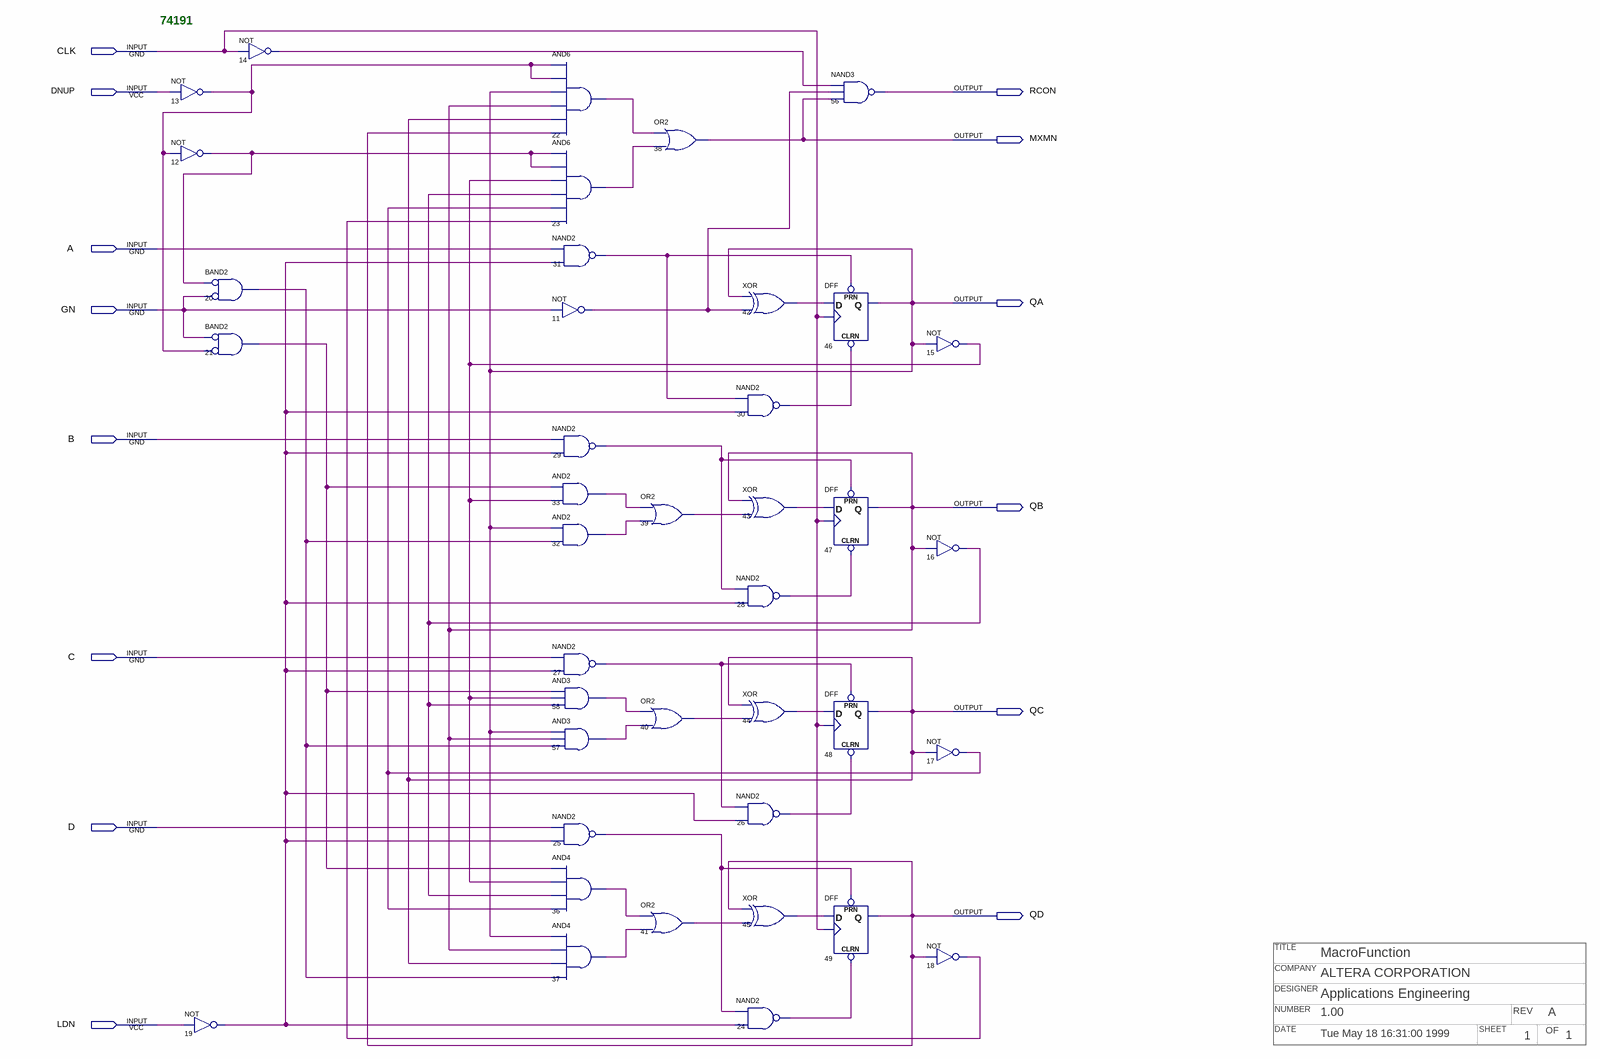
[diagram p0: schematic sheet]
// Quartus schematic p74191.bdf as structural Verilog: 40 symbols, 14 pins
// Title block: TITLE: MacroFunction; COMPANY: ALTERA CORPORATION; DESIGNER: Applications Engineering; NUMBER: 1.00; REV: A; DATE: Tue May 18 16:31:00 1999; SHEET: 1; OF: 1
module p74191 (
  input  CLK,
  input  DNUP,
  input  A,
  input  GN,
  input  B,
  input  C,
  input  D,
  input  LDN,
  output RCON,
  output MXMN,
  output QA,
  output QB,
  output QC,
  output QD
);

  wire n11_out, n12_out, n13_out, n14_out, n15_out, n16_out, n17_out, n18_out, n19_out, n20_out, n21_out,
       n22_out, n23_out, n24_out, n25_out, n26_out, n27_out, n28_out, n29_out, n30_out, n31_out, n32_out,
       n33_out, n36_out, n37_out, n39_out, n40_out, n41_out, n42_out, n43_out, n44_out, n45_out, n57_out,
       n58_out;

  not u_13 (n13_out, DNUP);
  not u_12 (n12_out, n13_out);
  not u_19 (n19_out, LDN);
  not u_14 (n14_out, CLK);
  and u_20 (n20_out, ~n12_out, ~GN);  // BAND2
  and u_21 (n21_out, ~GN, ~n13_out);  // BAND2
  and u_22 (n22_out, n13_out, n13_out, QA, QB, QC, QD);
  and u_23 (n23_out, n12_out, n12_out, n15_out, n16_out, n17_out, n18_out);
  nand u_31 (n31_out, A, n19_out);
  not u_11 (n11_out, GN);
  nand u_29 (n29_out, B, n19_out);
  and u_33 (n33_out, n21_out, n15_out);
  and u_32 (n32_out, QA, n20_out);
  nand u_27 (n27_out, C, n19_out);
  and u_58 (n58_out, n21_out, n15_out, n16_out);
  and u_57 (n57_out, QA, QB, n20_out);
  nand u_25 (n25_out, D, n19_out);
  and u_36 (n36_out, n21_out, n15_out, n16_out, n17_out);
  and u_37 (n37_out, QA, QB, QC, n20_out);
  or u_38 (MXMN, n22_out, n23_out);
  or u_39 (n39_out, n33_out, n32_out);
  or u_40 (n40_out, n58_out, n57_out);
  or u_41 (n41_out, n36_out, n37_out);
  xor u_42 (n42_out, QA, n11_out);
  nand u_30 (n30_out, n31_out, n19_out);
  xor u_43 (n43_out, QB, n39_out);
  nand u_28 (n28_out, n29_out, n19_out);
  xor u_44 (n44_out, QC, n40_out);
  nand u_26 (n26_out, n27_out, n19_out);
  xor u_45 (n45_out, QD, n41_out);
  nand u_24 (n24_out, n25_out, n19_out);
  nand u_56 (RCON, n14_out, n11_out, MXMN);
  DFF u_46 (.CLRN(n30_out), .CLK(CLK), .D(n42_out), .PRN(n31_out), .Q(QA));
  DFF u_47 (.CLRN(n28_out), .CLK(CLK), .D(n43_out), .PRN(n29_out), .Q(QB));
  DFF u_48 (.CLRN(n26_out), .CLK(CLK), .D(n44_out), .PRN(n27_out), .Q(QC));
  DFF u_49 (.CLRN(n24_out), .CLK(CLK), .D(n45_out), .PRN(n25_out), .Q(QD));
  not u_15 (n15_out, QA);
  not u_16 (n16_out, QB);
  not u_17 (n17_out, QC);
  not u_18 (n18_out, QD);

  // Notes on the sheet:
  //   74191
endmodule
